# EAGLE design Minniemouse_v2 (EAGLE 9.4.0)
COMPANY: ADAFRUIT INDUSTRIES; DRAWN: KTOWN; REV: B
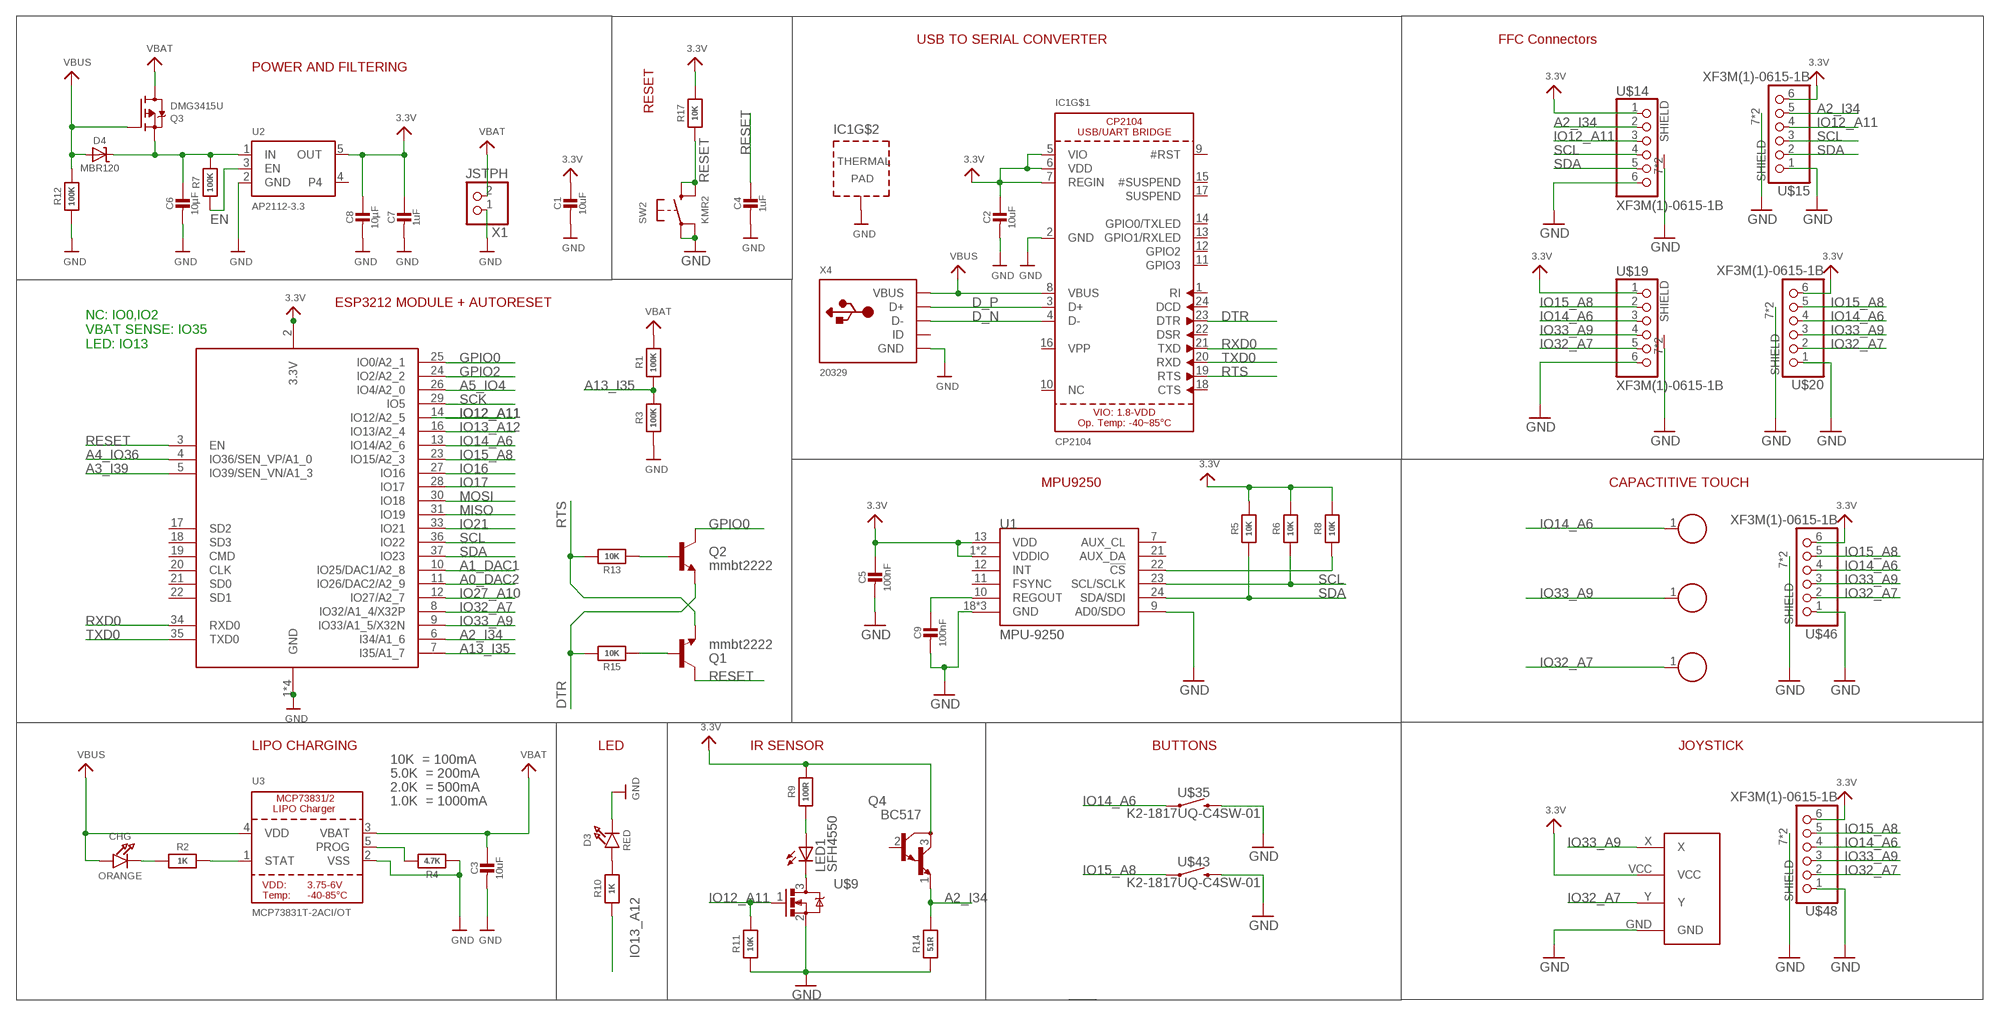
[diagram p0: schematic, sheet 1]

## Parts
C1  10uF  CAP_CERAMIC_0402  [_0402]
C2  10uF  CAP_CERAMIC_0402  [_0402]
C3  10uF  CAP_CERAMIC_0402  [_0402]
C4  1uF  CAP_CERAMIC_0402  [_0402]
C5  100nF  CAP_CERAMIC_0402  [_0402]
C6  10µF  CAP_CERAMIC_0402  [_0402]
C7  1uF  CAP_CERAMIC_0402  [_0402]
C8  10µF  CAP_CERAMIC_0402  [_0402]
C9  100nF  CAP_CERAMIC_0402  [_0402]
CHG  ORANGE  LED0805_NOOUTLINE  [CHIPLED_0805_NOOUTLINE]
D3  RED  LED0805_NOOUTLINE  [CHIPLED_0805_NOOUTLINE]
D4  MBR120  DIODE-SCHOTTKYSOD-123  [SOD-123]
IC1  CP2104  [QFN24_4MM_SMSC]
LED1  SFH4550  LED_LED5MM  [LED_LED5MM]
P1  CAPTOUCH_PAD  [CAPTOUCH_6.5X7]
P2  CAPTOUCH_PAD  [CAPTOUCH_6.5X7]
P3  CAPTOUCH_PAD  [CAPTOUCH_6.5X7]
Q1  mmbt2222  TRANSISTOR_NPNSOT23-3  [SOT23-3]
Q2  mmbt2222  TRANSISTOR_NPNSOT23-3  [SOT23-3]
Q3  DMG3415U  MOSFET-P  [SOT23-R]
Q4  BC517  [TO92]
R1  100K  RESISTOR_0402  [_0402]
R2  1K  RESISTOR_0402  [_0402]
R3  100K  RESISTOR_0402  [_0402]
R4  4.7K  RESISTOR_0402  [_0402]
R5  10K  RESISTOR_0402  [_0402]
R6  10K  RESISTOR_0402  [_0402]
R7  100K  RESISTOR_0402  [_0402]
R8  10K  RESISTOR_0402  [_0402]
R9  100R  RESISTOR_0402  [_0402]
R10  1K  RESISTOR_0402  [_0402]
R11  10K  RESISTOR_0402  [_0402]
R12  100K  RESISTOR_0402  [_0402]
R13  10K  RESISTOR_0402  [_0402]
R14  51R  RESISTOR_0402  [_0402]
R15  10K  RESISTOR_0402  [_0402]
R17  10K  RESISTOR_0402  [_0402]
SW2  KMR2  SWITCH_TACT_SMT4.6X2.8  [BTN_KMR2_4.6X2.8]
U1  MPU-9250  [QFN24_PAD]
U2  AP2112-3.3  VREG_SOT23-5  [SOT23-5]
U3  MCP73831T-2ACI/OT  MCP73831/2  [SOT23-5]
U$9  DMN6140L  [SOT91P240X110-3N]
U$14  XF3M(1)-0615-1B  [XF3M(1)-0615-1B]
U$15  XF3M(1)-0615-1B  [XF3M(1)-0615-1B]
U$19  XF3M(1)-0615-1B  [XF3M(1)-0615-1B]
U$20  XF3M(1)-0615-1B  [XF3M(1)-0615-1B]
U$35  K2-1817UQ-C4SW-01  [K2-1817UQ-C4SW-01]
U$43  K2-1817UQ-C4SW-01  [K2-1817UQ-C4SW-01]
U$46  XF3M(1)-0615-1B  [XF3M(1)-0615-1B]
U$48  XF3M(1)-0615-1B  [XF3M(1)-0615-1B]
U$49  JOYSTICK  [JOYSTICK]
X1  JSTPH  CON_JST_PH_2PIN  [JSTPH2]
X2  ESP32_WROOM32_SKINNY  [WROOM32_SKINNY]
X4  20329  USB_MICRO_20329_V2  [4UCONN_20329_V2]

## Nets
3.3V: C1.1 C2.1 C5.1 C7.1 C8.1 IC1.5(VIO) IC1.6(VDD) IC1.7(REGIN) Q4.3(C) R5.2 R6.2 R8.2 R9.2 R17.2 U1.1(VDDIO) U1.8(VDDIO) U1.13(VDD) U2.5(OUT) U$14.1 U$15.6 U$19.1 U$20.6 U$46.6 U$48.6 U$49.VCC X2.2(3.3V)
!CS: R8.1 U1.22(!CS)
A0_DAC2: X2.11(IO26/DAC2/A2_9)
A1_DAC1: X2.10(IO25/DAC1/A2_8)
A2_I34: Q4.1(E) R14.2 U$14.2 U$15.5 X2.6(I34/A1_6)
A3_I39: X2.5(IO39/SEN_VN/A1_3)
A4_IO36: X2.4(IO36/SEN_VP/A1_0)
A5_IO4: X2.26(IO4/A2_0)
A13_I35: R1.1 R3.2 X2.7(I35/A1_7)
D_N: IC1.4(D-) X4.D-
D_P: IC1.3(D+) X4.D+
DTR: IC1.23(DTR) Q2.2(E) R15.2
EN: R7.1 U2.3(EN)
GND: C1.2 C2.2 C3.2 C4.2 C5.2 C6.2 C7.2 C8.2 C9.2 D3.C IC1.2(GND) IC1.THERM(TP) R3.1 R4.1 R11.1 R12.1 R14.1 SW2.A'(P1) SW2.A(P) U1.9(AD0/SDO) U1.18(GND) U1.20(GND) U1.CENTER(GND) U2.2(GND) U3.2(VSS) U$9.2 U$14.6 U$14.7(SHIELD) U$14.8(SHIELD) U$15.1 U$15.7(SHIELD) U$15.8(SHIELD) U$19.6 U$19.7(SHIELD) U$19.8(SHIELD) U$20.1 U$20.7(SHIELD) U$20.8(SHIELD) U$35.P$2 U$43.P$2 U$46.1 U$46.7(SHIELD) U$46.8(SHIELD) U$48.1 U$48.7(SHIELD) U$48.8(SHIELD) U$49.GND X1.1 X2.1(GND) X2.15(GND) X2.38(GND) X2.P$1(GND) X4.BASE@1(GND) X4.BASE@2(GND) X4.GND X4.SPRT@1(GND) X4.SPRT@2(GND) X4.SPRT@3(GND) X4.SPRT@4(GND)
GPIO0: Q2.3(C) X2.25(IO0/A2_1)
GPIO2: X2.24(IO2/A2_2)
IO12_A11: R11.2 U$9.1 U$14.3 U$15.4 X2.14(IO12/A2_5)
IO13_A12: R10.1 X2.16(IO13/A2_4)
IO14_A6: P1.1 U$19.3 U$20.4 U$35.P$1 U$46.4 U$48.4 X2.13(IO14/A2_6)
IO15_A8: U$19.2 U$20.5 U$43.P$1 U$46.5 U$48.5 X2.23(IO15/A2_3)
IO16: X2.27(IO16)
IO17: X2.28(IO17)
IO21: X2.33(IO21)
IO27_A10: X2.12(IO27/A2_7)
IO32_A7: P3.1 U$19.5 U$20.2 U$46.2 U$48.2 U$49.Y X2.8(IO32/A1_4/X32P)
IO33_A9: P2.1 U$19.4 U$20.3 U$46.3 U$48.3 U$49.X X2.9(IO33/A1_5/X32N)
MISO: X2.31(IO19)
MOSI: X2.30(IO18)
N$1: CHG.C R2.1
N$3: R2.2 U3.1(STAT)
N$4: R4.2 U3.5(PROG)
N$5: D3.A R10.2
N$7: C6.1 D4.C Q3.2(S) R7.2 U2.1(IN)
N$8: Q2.1(B) R13.1
N$9: LED1.A R9.1
N$10: LED1.K(C) U$9.3
N$12: Q1.1(B) R15.1
REGOUT: C9.1 U1.10(REGOUT)
RESET: C4.1 Q1.3(C) R17.1 SW2.B'(S1) SW2.B(S) X2.3(EN)
RTS: IC1.19(RTS) Q1.2(E) R13.2
RXD0: IC1.21(TXD) X2.34(RXD0)
SCK: X2.29(IO5)
SCL: R6.1 U1.23(SCL/SCLK) U$14.4 U$15.3 X2.36(IO22)
SDA: R5.1 U1.24(SDA/SDI) U$14.5 U$15.2 X2.37(IO23)
TXD0: IC1.20(RXD) X2.35(TXD0)
VBAT: C3.1 Q3.3(D) R1.2 U3.3(VBAT) X1.2
VBUS: CHG.A D4.A IC1.8(VBUS) Q3.1(G) R12.2 U3.4(VDD) X4.VBUS
Unconnected: IC1.1(RI) IC1.9(#RST) IC1.10(NC) IC1.11(GPIO3) IC1.12(GPIO2) IC1.13(GPIO1/RXLED) IC1.14(GPIO0/TXLED) IC1.15(#SUSPEND) IC1.16(VPP) IC1.17(SUSPEND) IC1.18(CTS) IC1.22(DSR) IC1.24(DCD) Q4.2(B) U1.7(AUX_CL) U1.11(FSYNC) U1.12(INT) U1.21(AUX_DA) U2.4 X2.17(SD2) X2.18(SD3) X2.19(CMD) X2.20(CLK) X2.21(SD0) X2.22(SD1) X4.ID

## Notes on the sheet
- USB TO SERIAL CONVERTER | FFC Connectors
- POWER AND FILTERING
- RESET
- ESP3212 MODULE + AUTORESET
- NC: IO0,IO2
  VBAT SENSE: IO35
  LED: IO13
- MPU9250 | CAPACTITIVE TOUCH
- LIPO CHARGING | LED | IR SENSOR | BUTTONS | JOYSTICK
- 10K  = 100mA
- 5.0K  = 200mA
- 2.0K  = 500mA
- 1.0K  = 1000mA

## Library data of the parts
C1-C9 = microbuilder:CAP_CERAMIC: Ceramic Capacitors For new designs, use the packages preceded by an '_' character since they are more reliable: The following footprints should be used on most boards: _0402 - Standard footprint for regular board layouts _0603 - Standard footprint for regular board layouts _0805 - Standard footprint for regular board layouts _1206 - Standard footprint for regular board layouts For extremely tight-pitch boards where space is at a premium, the following 'micro-pitch' footprints can be used (smaller pads, no silkscreen outline, etc.): _0402MP - Micro-pitch footprint for very dense/compact boards _0603MP - Micro-pitch footprint for very dense/compact boards _0805MP - Micro-pitch footprint for very dense/compact boards _1206MP - Micro-pitch footprint for very dense/compact boards
CHG D3 = microbuilder:LED: LED 0603 - 0603 Surface Mount Package 2mA: Green LED - Low Power (3.9mcd, 2ma, 1.7Vf) - Digikey: 475-2709-2-ND Orange LED - Low Power (9.8mcd, 2ma, 1.8Vf) - Digikey: 475-1194-2-ND Red LED - Low Power (5mcd, 2ma, 1.8Vf) - Digikey: 475-1195-2-ND Yellow LED - Low Power (7mcd, 2ma, 1.8Vf) - Digikey: 475-1196-2-ND 5mA: Blue LED - Low Power (17mcd, 5ma, 2.9Vf) - Digikey: LNJ937W8CRACT-ND 0805 - 0805 Surface Mount Package 2mA: Red LED (8.8mcd, 2mA, 1.8Vf, Clear) - Low Power [Digikey: 475-2510-1-ND] Green LED (5mcd, 2mA, 1.8Vf, Clear) - Low Power [Digikey: 475-2730-1-ND] Yellow LED (11.3mcd, 2mA, 1.8Vf, Clear) - Low Power [Digikey: 475-2555-1-ND] 20mA: Red LED (104mcd, 20mA, Diffused) - LS R976 [Digikey: 475-1278-6-ND] Red LED (12mcd, 20mA, 2.0Vf, Clear) - APT2012EC [Digikey: 754-1128-1-ND] Green LED (15mcd, 20mA, 2.2Vf, Clear) - APT2012GC [Digikey: 754-1131-1-ND] Orange LED (160mcd, 20mA, 2.1Vf, Clear) - APT2012SECK [Digikey: 754-1130-1-ND] 1206 - 1206 Surface Mount Package Green LED (26mcd, 20mA, Diffused) - LG N971 [Digikey: 475-1407-6-ND] Red LED (15mcd, 20mA, Diffused) - LH N974 [Digikey: 475-1416-6-ND] Cree - Cree High-Power Surface Mount LEDs XPEBWT-L1-0000-00D50 - White 111lm 350mA 2.9Vf 6200K 110° XTEAWT-00-0000-00000LEE3 - White 114lm 350mA 2.85Vf 5000K 115° Everlight - Everlight 45-21 Series Surface Mount LEDs 45-21/QK2C-B2832AC2CB2/2T - Warm White 2000mcd 20mA 3.25Vf 3050K 120° 45-21/LK2C-B38452C4CB2/2T - Nuetral White 2000mcd 20mA 3.25Vf 4150K 120° 45-21/LK2C-B50634C6CB2/2T - Cold White 2200mcd 20mA 3.25Vf 5650K 120° PLCC2 Reverse Mount LS T77K-J1L2-1-0-2-R18-Z - Red 11.25mcd 2mA 1.8Vf 630nm 120° LO T77K-L1M2-24-Z - Orange 19.6mcd 2mA 1.8Vf 606nm 120° LY T77K-K2M1-26-Z - Yellow 15.7mcd 2mA 1.8Vf 587nm 120°
D4 = microbuilder:DIODE-SCHOTTKY
IC1 = microbuilder:CP2104: CP2104 - USB to UART Bridge VDD Output: 3.45V
LED1 = Arduino_Micro:LED_LED: LED OSRAM: - CHIPLED LG R971, LG N971, LY N971, LG Q971, LY Q971, LO R971, LY R971 LH N974, LH R974 LS Q976, LO Q976, LY Q976 LO Q996 - Hyper CHIPLED LW Q18S LB Q993, LB Q99A, LB R99A - SideLED LS A670, LO A670, LY A670, LG A670, LP A670 LB A673, LV A673, LT A673, LW A673 LH A674 LY A675 LS A676, LA A676, LO A676, LY A676, LW A676 LS A679, LY A679, LG A679 - Hyper Micro SIDELED® LS Y876, LA Y876, LO Y876, LY Y876 LT Y87S - SmartLED LW L88C, LW L88S LB L89C, LB L89S, LG L890 LS L89K, LO L89K, LY L89K LS L896, LA L896, LO L896, LY L896 - TOPLED LS T670, LO T670, LY T670, LG T670, LP T670 LSG T670, LSP T670, LSY T670, LOP T670, LYG T670 LG T671, LOG T671, LSG T671 LB T673, LV T673, LT T673, LW T673 LH T674 LS T676, LA T676, LO T676, LY T676, LB T676, LH T676, LSB T676, LW T676 LB T67C, LV T67C, LT T67C, LS T67K, LO T67K, LY T67K, LW E67C LS E67B, LA E67B, LO E67B, LY E67B, LB E67C, LV E67C, LT E67C LW T67C LS T679, LY T679, LG T679 LS T770, LO T770, LY T770, LG T770, LP T770 LB T773, LV T773, LT T773, LW T773 LH T774 LS E675, LA E675, LY E675, LS T675 LS T776, LA T776, LO T776, LY T776, LB T776 LHGB T686 LT T68C, LB T68C - Hyper Mini TOPLED® LB M676 - Mini TOPLED Santana® LG M470 LS M47K, LO M47K, LY M47K Source: http://www.osram.convergy.de LUXEON: - LUMILED® LXK2-PW12-R00, LXK2-PW12-S00, LXK2-PW14-U00, LXK2-PW14-V00 LXK2-PM12-R00, LXK2-PM12-S00, LXK2-PM14-U00 LXK2-PE12-Q00, LXK2-PE12-R00, LXK2-PE12-S00, LXK2-PE14-T00, LXK2-PE14-U00 LXK2-PB12-K00, LXK2-PB12-L00, LXK2-PB12-M00, LXK2-PB14-N00, LXK2-PB14-P00, LXK2-PB14-Q00 LXK2-PR12-L00, LXK2-PR12-M00, LXK2-PR14-Q00, LXK2-PR14-R00 LXK2-PD12-Q00, LXK2-PD12-R00, LXK2-PD12-S00 LXK2-PH12-R00, LXK2-PH12-S00 LXK2-PL12-P00, LXK2-PL12-Q00, LXK2-PL12-R00 Source: www.luxeon.com KINGBRIGHT: KA-3528ASYC Source: www.kingbright.com
P1-P3 = Minniemouse_v2:CAPTOUCH_PAD
Q1 Q2 = SparkFun:TRANSISTOR_NPN: Transistor NPN BJT configuration in SOT23 package. MMBT2222 is the common NPN we use. Double check BCE configuration again layout.
Q3 = microbuilder:MOSFET-P: P-Channel Mosfet LEGEND VDS: Voltage Drain-Source ID: Drain Current RDS(ON): Drain-Source On-State Resistance VGS(TH): Gate-Source Threshold Voltage CISS: Drain-Source Input Capacitance SOT-23 Name VDS ID RDS(ON) VGS(TH) CISS Order Number IRLML5103 30V 760mA 600 mOhm -- 75pF @ 25V Digikey: IRLML5103PBFCT-ND IRLML6401 12V 4.3A 50 mOhm 950mV @ 250µA 830pF @ 10V Digikey: IRLML6401PBFTR-ND NTR0202PL 20V 400mA 800 mOhm 2.3V @ 250uA 70pF @ 5V Digikey: NTR0202PLT1GOSTR-ND NTR4101PT1G 20V 1.8A 85 mOhm 1.2V @ 250uA 675pF @ 10V Digikey: NTR4101PT1GOSCT-ND DMP2004K 20V 600mA 900 mOhm 1V @ 250uA 175pF @ 16V Digikey: DMP2004KDICT-ND PMV65XP 20V 3.9A 76 mOhm 950mV @ 1mA 725pF @ 20V Digikey: 568-2358-2-ND TO-252 Name VDS ID RDS(ON) VGS(TH) CISS Order Number AOD417 30V 25A 34 mOhm 3V @ 250µA 920pF @ 15V Digikey: 785-1106-2-ND PowerPak Name VDS ID RDS(ON) VGS(TH) CISS Order Number AON7401 30V 12A 14 mOhm 3V @ 250µA 2600pF @ 15V Digikey: 785-1302-1-ND
Q4 = transistor-npn:BC517*: NPN Darlington Transistor
R1-R15 R17 = microbuilder:RESISTOR: Resistors For new designs, use the packages preceded by an '_' character since they are more reliable: The following footprints should be used on most boards: _0402 - Standard footprint for regular board layouts _0603 - Standard footprint for regular board layouts _0805 - Standard footprint for regular board layouts _1206 - Standard footprint for regular board layouts For extremely tight-pitch boards where space is at a premium, the following 'micro-pitch' footprints can be used (smaller pads, no silkscreen outline, etc.): _0402MP - Micro-pitch footprint for very dense/compact boards _0603MP - Micro-pitch footprint for very dense/compact boards _0805MP - Micro-pitch footprint for very dense/compact boards _1206MP - Micro-pitch footprint for very dense/compact boards
SW2 = microbuilder:SWITCH_TACT_SMT: SMT Tact Switches 6x6mm - Digikey: P12940SCT-ND KMR2 (4.6x2.8mm) - Digikey: 401-1426-1-ND EVQ-PQHB55 - Light Touch, 160GF (4.5x4.5mm) - Digikey: P8090SCT-ND KMT0 - KMT021 NGJ LHS (etc.) IP68/Waterproof - Digikey: CKN10289CT-ND
U1 = Testing:MPU-9250: NC pin 19. 2-6 & 14-17 not internally connected. May be used for PCB trace routing.; PROD_ID: IC-13192
U2 = microbuilder:VREG_SOT23-5: SOT23-5 Fixed Voltage Regulators Part Current Out V Out V In V Dropout θJA (°C/W) TJ (°C) Digikey Part No. ADP121 150mA 3.3V 3.4-5.5V 0.09V @ 150mA -- -- ADP121-AUJZ33R7CT-ND ADP121 150mA 3.0V 3.1-5.5V 0.09V @ 150mA -- -- ADP121-AUJZ30R7CT-ND ADP122 300mA 3.3V 3.4-5.5V 0.085V @ 300mA -- -- ADP122AUJZ-3.3-R7CT-ND ADP1712 300mA 3.3V 3.5-5.5V 0.17V @ 300mA -- -- ADP1712AUJZ-3.3-R7TR-ND AP7311 (Low Cost) 150mA 3.3V 3.5-6V 0.15V @ 150mA -- -- AP7311-33WG-7DICT-ND LD39015M18R 150mA 1.8V 1.9V-5.5V 0.08V @ 100mA -- -- 497-6977-1-ND LP2985A-33DBVR 150mA 3.3V 3.3-16V 0.28V @ 150mA 206 150 296-18479-1-ND MCP1824T-3302E/OT 300mA 3.3V 3.5V-6V 0.2V @ 300mA -- -- MCP1824T-3302E/OTCT-ND MIC5205-2.5YM5 TR 150mA 2.5V 2.7-16V 0.165V @ 150mA -- -- 576-1257-2-ND MIC5205-3.0YM5 TR 150mA 3.0V 3.2V-16V 0.165V @ 150mA -- -- 576-1258-2-ND MIC5205-3.3YM5 TR 150mA 3.3V 3.5V-16V 0.165V @ 150mA -- -- 576-1259-2-ND TPS780330220 150mA 3.3V+2.2V 3.6-5.5V 250mV Max -- -- 296-23332-1-ND TDA3663/N1,135 100mA 3.3V 3.5-45V 0.18V @ 50mA -- -- 568-5343-1-ND Max operating temp can be calculated using θJA, TJ (max junction temperature), and power in watts. Set the "Maximum Ambient Temperature" until it reaches TJ ("Max Junction Temperature"), which is the absolute limit for safe use of the regulator: Heat Sink Temperature Calculator <http://www.daycounter.com/Calculators/Heat-Sink-Temperature-Calculator.phtml> For example, With 12V source into a 3.3V LP2985 and a 30mA load, we are dissipating (12V-3.3V) * 0.03A = 0.261W. With a θJA of 206 °C/W, a TJ of 150°C, and 261mW we can safely use the chip without a heat sink up to 75°C (=147.1°C Junction Temperature).
U3 = microbuilder:MCP73831/2: MCP73831/2 LIPO Charger VDD: 3.75 - 6V Temp -40 - 85°C Programmable Charge Rate: 15-500mA NOTE: STAT is a tri-state logic output on the MCP73831 and an open-drain output on the MCP73832. SOT23-5 with 4.2V output and tri-state logic on STAT = MCP73831T-2ACI/OT
U$9 = DMN6140L:DMN6140L
U$14 U$15 U$19 U$20 U$46 U$48 = Neptune_custom_lib:XF3M(1)-0615-1B: 6P FFC connector
U$35 U$43 = Adafruit ESP8266 Feather rev E:K2-1817UQ-C4SW-01
U$49 = Minniemouse_v2:JOYSTICK
X1 = microbuilder:CON_JST_PH_2PIN: JST 2-Pin Right-Angle Connector PH-Series - 4UConnector: 17311 SH-Series - 4UConnector: 07278
X2 = microbuilder:ESP32_WROOM32
X4 = microbuilder:USB: USB Connectors USBMINIB - Surface Mount Female Mini-B USB Connector 4UConnector: 06564

## Board
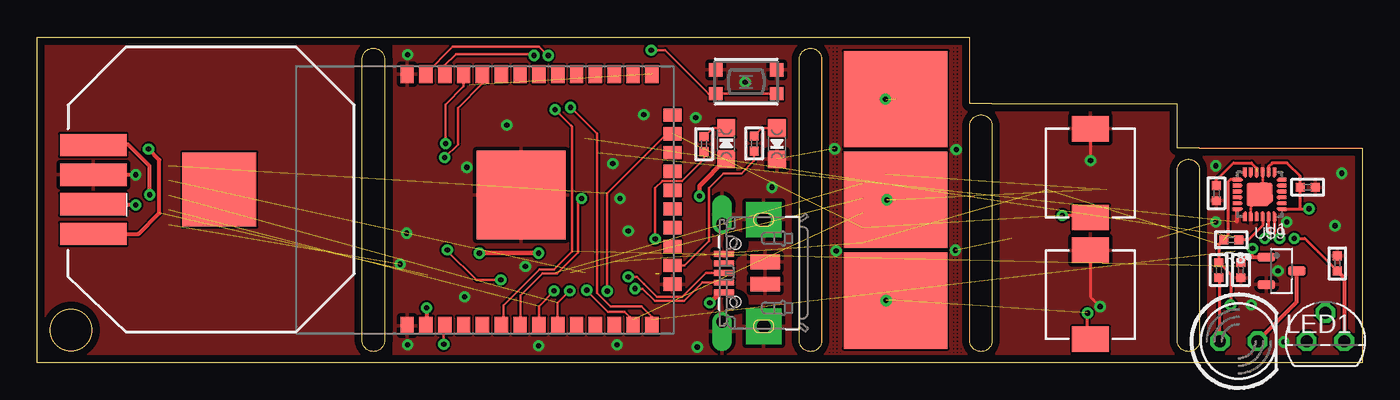
[diagram p1: board, top side]
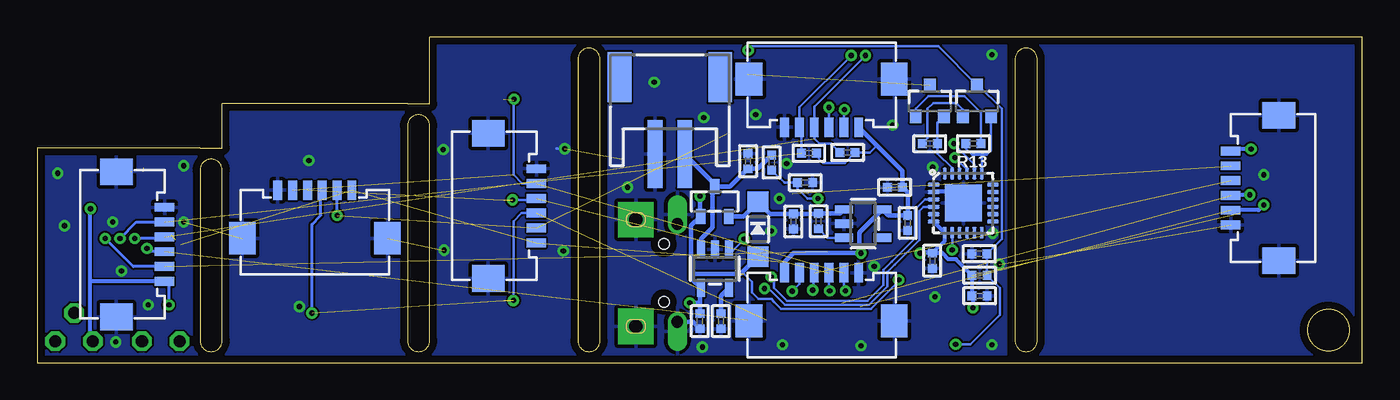
[diagram p2: board, bottom side, seen from below]

Size 89.45 x 22 mm. Coordinates in mm from the lower left corner, seen from the top.
Outline: 0,22 62.95,22 62.95,17.5 64.45,17.5 76.95,17.5 76.95,14.5 78.45,14.5 89.45,14.5 89.45,0 78.45,0 76.95,0 64.45,0 62.95,0 0,0 0,22
Outline: 64.45,16 64.45,1.5 arc-180 62.95,1.5 62.95,16 arc-180 64.45,16
Outline: 78.45,13 78.45,1.5 arc-180 76.95,1.5 76.95,13 arc-180 78.45,13
Outline: 52.95,20.5 52.95,1.5 arc-180 51.45,1.5 51.45,20.5 arc-180 52.95,20.5
Outline: 23.45,20.5 23.45,1.5 arc-180 21.95,1.5 21.95,20.5 arc-180 23.45,20.5
Outline: circle at 2.3,2.2 radius 1.4
Copper layers (1*16): Top 0.035mm / dielectric 1.5mm / Bottom 0.035mm
Design rules "default *": minimum track width 6mil, minimum drill 0.35mm, track to track 5mil, track to pad 4mil, pad to pad 4mil, via to via 5mil, smd to smd 5mil, copper to edge 20mil, drill to drill 6mil, minimum pad ring 10mil, minimum via ring 8mil, stop-mask expansion 4mil, vias tented up to drill 0.4mm, thermal gap 10mil

### Footprints (pad centres in the part's own frame; a part is rotated, then mirrored left to right if it is on the bottom)
_0402 = smd 0.6 x 0.6: 1 -0.508,0; 2 0.508,0
CHIPLED_0805_NOOUTLINE = smd 1.2 x 1.2: A 0,-1.05; C 0,1.05
SOD-123 = smd 1.4 x 1.4: A 1.85,0; C -1.85,0
QFN24_4MM_SMSC = smd 0.8 x 0.28: 1 -2,1.25; 2 -2,0.75; 3 -2,0.25; 4 -2,-0.25; 5 -2,-0.75; 6 -2,-1.25; 13 2,-1.25; 14 2,-0.75; 15 2,-0.25; 16 2,0.25; 17 2,0.75; 18 2,1.25 | smd 0.28 x 0.8: 7 -1.25,-2; 8 -0.75,-2; 9 -0.25,-2; 10 0.25,-2; 11 0.75,-2; 12 1.25,-2; 19 1.25,2; 20 0.75,2; 21 0.25,2; 22 -0.25,2; 23 -0.75,2; 24 -1.25,2 | smd 2.5 x 2.5: THERM 0,0
LED_LED5MM = drill 0.813 octagon: A -1.27,0; K 1.27,0
CAPTOUCH_6.5X7 = smd 6.5 x 7: 1 0,0
SOT23-3 = smd 0.8 x 0.9: 1 -0.95,-1; 2 0.95,-1; 3 0,1.1
SOT23-R = smd 0.635 x 1.016: 1 -0.95,-1; 2 0.95,-1; 3 0,1
TO92 = drill 0.813 octagon: 1 1.27,0; 2 0,1.905; 3 -1.27,0
BTN_KMR2_4.6X2.8 = smd 0.9 x 0.9: A 2.05,0.8; A' -2.05,0.8; B 2.05,-0.8; B' -2.05,-0.8
QFN24_PAD = smd 0.5 x 0.25: 1 -1.55,1; 2 -1.55,0.6; 3 -1.55,0.2; 4 -1.55,-0.2; 5 -1.55,-0.6; 6 -1.55,-1; 13 1.55,-1; 14 1.55,-0.6; 15 1.55,-0.2; 16 1.55,0.2; 17 1.55,0.6; 18 1.55,1 | smd 0.08 x 0.13: 1$1 -1.32,1.06; 1$3 -1.26,0.94; P$33 1.26,-0.94; P$34 1.32,-1.06; P$58 1.26,0.94; P$59 1.32,1.06; P$68 -1.26,-0.94; P$69 -1.32,-1.06 | smd 0.1 x 0.185 rotated 45: 1$2 -1.25,1.024; P$49 1.024,-1.25 | smd 0.14 x 0.14: 1$4 -1.22,0.945; P$23 -0.945,-1.22; P$24 1.22,-0.945; P$36 0.945,1.22; P$51 0.945,-1.22; P$56 1.22,0.945; P$61 -0.945,1.22; P$66 -1.22,-0.945 | smd 0.05 x 0.05: 1$5 -1.175,0.97; P$25 -0.97,-1.175; P$31 1.175,-0.97; P$37 0.97,1.175; P$52 0.97,-1.175; P$57 1.175,0.97; P$62 -0.97,1.175; P$67 -1.175,-0.97 | smd 0.25 x 0.5: 7 -1,-1.55; 8 -0.6,-1.55; 9 -0.2,-1.55; 10 0.2,-1.55; 11 0.6,-1.55; 12 1,-1.55; 19 1,1.55; 20 0.6,1.55; 21 0.2,1.55; 22 -0.2,1.55; 23 -0.6,1.55; 24 -1,1.55 | smd 0.25 x 0.25: CENTER 0,0 | smd 0.4 x 0.4: DBBADFE -0.675,0.24 | smd 0.6 x 1.2: DBBADFE1 -0.575,-0.195 | smd 0.25 x 0.3: P$1 -0.2,1.3; P$3 0.2,1.3; P$5 0.6,1.3; P$11 -0.6,1.3; P$16 0.2,-1.3; P$18 -0.2,-1.3; P$20 -0.6,-1.3; P$26 0.6,-1.3 | smd 0.3 x 0.25: P$2 -1.3,0.2; P$4 -1.3,0.6; P$28 -1.3,-0.2; P$38 -1.3,-0.6; P$40 1.3,0.2; P$42 1.3,-0.2; P$44 1.3,-0.6; P$50 1.3,0.6 | smd 0.1 x 0.185 rotated 225: P$7 1.25,-1.024; P$60 -1.024,1.25 | smd 1.1 x 1.59: P$13 0.325,0 | smd 0.3 x 0.5 rotated 315: P$14 -0.592,0.512 | smd 0.5 x 1.59: P$15 -0.27,0 | smd 0.1 x 0.185 rotated 135: P$22 -1.024,-1.25; P$55 1.25,1.024 | smd 0.13 x 0.08: P$27 -0.94,-1.26; P$29 -1.06,-1.32; P$39 0.94,1.26; P$41 1.06,1.32; P$53 0.94,-1.26; P$54 1.06,-1.32; P$63 -0.94,1.26; P$64 -1.06,1.32 | smd 0.1 x 0.185 rotated 315: P$35 1.024,1.25; P$65 -1.25,-1.024
SOT23-5 = smd 0.55 x 1.2: 1 -0.95,-1.3; 2 0,-1.3; 3 0.95,-1.3; 4 0.95,1.3; 5 -0.95,1.3
SOT91P240X110-3N = smd 1.18 x 0.61: 1 -1.025,0.915; 2 -1.025,-0.915; 3 1.025,0
XF3M(1)-0615-1B = smd 0.6 x 1.3: 1 -2.5,0; 2 -1.5,0; 3 -0.5,0; 4 0.5,0; 5 1.5,0; 6 2.5,0 | smd 1.8 x 2.2: 7 -4.9,-3.25; 8 4.9,-3.25
K2-1817UQ-C4SW-01 = smd 1.7 x 2.5: P$1 -3,0; P$2 3,0
JOYSTICK = smd 5 x 5: 1 0,-8.5 | smd 1.5 x 4.5: GND 1,0; VCC -3,0; X 3,0; Y -1,0
JSTPH2 = smd 1 x 4.6: 1 -1,-3.7; 2 1,-3.7 | smd 1.6 x 3.4: NC1 -3.4,1.5; NC2 3.4,1.5
WROOM32_SKINNY = smd 1.2 x 0.9: 1 -8.5,5; 2 -8.5,3.73; 3 -8.5,2.46; 4 -8.5,1.19; 5 -8.5,-0.08; 6 -8.5,-1.35; 7 -8.5,-2.62; 8 -8.5,-3.89; 9 -8.5,-5.16; 10 -8.5,-6.43; 11 -8.5,-7.7; 12 -8.5,-8.97; 13 -8.5,-10.24; 14 -8.5,-11.51; 25 8.5,-11.51; 26 8.5,-10.24; 27 8.5,-8.97; 28 8.5,-7.7; 29 8.5,-6.43; 30 8.5,-5.16; 31 8.5,-3.89; 32 8.5,-2.62; 33 8.5,-1.35; 34 8.5,-0.08; 35 8.5,1.19; 36 8.5,2.46; 37 8.5,3.73; 38 8.5,5 | smd 0.9 x 1.2: 15 -5.7,-12.9; 16 -4.43,-12.9; 17 -3.16,-12.9; 18 -1.89,-12.9; 19 -0.62,-12.9; 20 0.65,-12.9; 21 1.92,-12.9; 22 3.19,-12.9; 23 4.46,-12.9; 24 5.73,-12.9 | smd 6 x 6: P$1 0.34,-2.7
4UCONN_20329_V2 = smd 1 x 2: BASE@1 -0.75,-2; BASE@2 0.75,-2 | smd 0.4 x 1.35: D+ 0,0.775; D- -0.65,0.775; GND 1.3,0.775; ID 0.65,0.775; VBUS -1.3,0.775 | drill 0.8 pad 1.143 offset: SPRT@1 -3.3,0.9; SPRT@2 3.3,0.9 | drill 0.9 pad 2.413 square: SPRT@3 -3.6,-1.9; SPRT@4 3.6,-1.9 | hole 0.7: -1.95,0; 1.95,0

### Placement (x,y rotation side)
C1  25.84,4.52 0 bottom
C2  29.03,6.89 270 bottom
C3  41.46,13.61 90 bottom
C4  25.86,7.36 180 bottom
C5  85.75,11.85 0 top
C6  38.41,9.54 270 bottom
C7  31.56,11.85 180 bottom
C8  30.69,9.44 270 bottom
C9  79.6,11.45 270 top
CHG  46.51,14.81 0 top
D3  49.93,14.79 180 top
D4  40.8,9.02 270 bottom
IC1  26.94,10.78 0 bottom
LED1  81.1,1.45 0 top
P1  57.95,4.2 90 top
P2  57.95,11 90 top
P3  57.95,17.8 90 top
Q1  26.01,17.65 0 bottom
Q2  29.2,17.65 0 bottom
Q3  43.72,10.89 0 bottom
Q4  86.95,1.45 0 top
R1  39.87,13.53 90 bottom
R2  45.02,14.76 270 top
R3  37.61,12.16 180 bottom
R4  43.3,2.81 90 bottom
R5  37.35,14.15 0 bottom
R6  34.75,14.2 0 bottom
R7  36.71,9.56 90 bottom
R8  80.6,8.3 180 top
R9  79.75,6.25 90 top
R10  48.4,14.81 90 top
R11  81.25,6.25 90 top
R12  44.72,2.81 90 bottom
R13  26.25,14.8 180 bottom
R14  87.75,6.7 270 top
R15  29.2,14.8 0 bottom
R17  25.84,5.9 180 bottom
SW2  47.86,18.98 0 top
U1  82.51,11.37 180 top
U2  33.7,9.39 270 bottom
U3  43.7,6.35 180 bottom
U$9  83.99,6.2 0 top
U$14  36.5,15.9 180 bottom
U$15  80.85,8 270 bottom
U$19  36.5,6.08 0 bottom
U$20  70.7,11.65 0 bottom
U$35  71.09,4.6 90 top
U$43  71.1,12.8 90 top
U$46  55.75,10.6 270 bottom
U$48  8.9,11.8 90 bottom
U$49  3.8,11.7 90 top
X1  46.74,17.79 0 bottom
X2  29.98,11 90 top
X4  47.14,6.06 90 top

### Tracks (layer width: path | path; a pad name or v marks a point on that pad's centre or on a via)
3.3V  (via drill 0.35)  (6 unrouted)
  Top 0.203: 85.25,12.6 84.35,13.5 83.35,13.5 83.11,13.26 83.11,12.87 | U1.13 80.52,12.37 80.35,12.2 80.35,8.6 79.75,8 R9.2 80.55,5.96 v80.55,3.9 | U1.1 84.75,10.37 85.25,10.37 | 85.25,10.37 85.82,10.37 v85.85,10.4 | 85.25,10.37 85.25,12.6 | C5.1 85.24,12.59 85.25,12.6
  Top 0.254: v26.3,3.7 26.3,2.55 | U$49.VCC 6.85,8.7 8.25,10.1 8.25,13.7 v7.53,14.42 v7.52,14.42
  Top 0.305: X2.2 26.3,2.55 | v29.85,7.4 v33.85,7.4
  Bottom 0.152: 28.19,8.75 IC1.7 | 32.77,14.68 33.25,14.2 R6.2 34.94,13.5 36.4,13.5 36.84,13.94 R5.2
  Bottom 0.203: U$15.6 80.55,5.2 v80.55,3.9 | Q4.3 85.89,1.66
  Bottom 0.254: U$15.6 85.69,5.5 85.89,5.5 | v85.85,10.4 85.89,10.36 85.89,5.5 | 85.89,5.5 85.89,1.66 | IC1.7 IC1.6 IC1.5 | C2.1 28.19,8.24 28.19,8.75 | 28.6,7.4 28.36,7.4 27.95,6.98 27.43,6.98 R17.2 C1.1 26.3,4.52 v26.3,3.7 | v7.52,14.42 8.78,14.42 U$48.6
  Bottom 0.305: U$19.1 39,6.8 38.4,7.4 33.95,7.4 | v29.85,7.4 29.65,7.4 29.65,7.45 29.08,7.45 C2.1 28.6,7.4 28.55,7.4 | U$14.1 32.77,14.68 32.4,14.3 31.05,12.95 C7.1 30.69,11.49 C8.1 32.01,9.95 U2.5 33.95,8.79 33.95,7.4 | v33.85,7.4 33.95,7.4
!CS
  Top 0.203: U1.22 82.71,9.26 81.75,8.3 R8.1
A2_I34  (via drill 0.35)  (1 unrouted)
  Top 0.152: v34.95,17.1 36.05,16 36.1,15.95 36.1,7.53 34.88,6.31 33.91,6.31 31.47,3.87 31.47,2.64 X2.6
  Top 0.203: v84.85,8.4 85.54,8.4 R14.2
  Top 0.254: R14.2 88.22,5.72 Q4.1
  Bottom 0.152: U$14.2 35,17.05 v34.95,17.1
  Bottom 0.203: U$15.5 82.95,6.5 v84.85,8.4
A13_I35  (via drill 0.35)
  Top 0.152: v36.75,11.1 36.5,10.85 36.5,7.45 35.08,6.03 34.11,6.03 32.62,4.54 32.62,2.52 X2.7
  Bottom 0.152: R1.1 39.01,12.16 R3.2 38.12,11.77 37.45,11.1 v36.75,11.1
D_N  (via drill 0.35)
  Top 0.152: X4.D- 44.91,5.41 43.66,4.16 41.7,4.16 40.86,5 v40.35,5
  Bottom 0.152: v40.35,5 40.05,5 38.96,3.91 33.29,3.91 32.06,5.14 32.06,5.8 32.06,6.14 31.55,6.65 29.91,8.29 29.91,9.1 29.91,10.25 29.63,10.53 IC1.4
D_P  (via drill 0.35)
  Top 0.152: X4.D+ 45.16,6.06 43.54,4.44 41.9,4.44 41.85,4.44 40.95,5.34 40.49,5.8 v39.9,5.8
  Bottom 0.152: 32.34,5.26 33.41,4.19 38.84,4.19 39.7,5.05 39.7,5.6 v39.9,5.8 | 32.34,5.26 32.34,5.5 | 32.34,5.26 32.34,5.5 | 32.34,5.5 32.34,6.26 31.75,6.85 30.19,8.41 30.19,10.37 29.52,11.03 IC1.3
DTR
  Bottom 0.152: Q2.2 28.69,16.21 R15.2 28.69,14.14 27.69,13.14 IC1.23
EN
  Bottom 0.152: U2.3 36.1,8.44 R7.1
GND  (via drill 0.35)  (4 unrouted)
  Top 0.152: U1.9 82.71,11.57 U1.CENTER 82.51,11.07 81.91,10.47 U1.20 | 80.96,9.54 81,9.5
  Top 0.203: U$35.P$2 71.09,4.45 v71.74,3.79 | U$43.P$2 v71.1,13.65
  Top 0.254: U1.18 80.96,9.54 | U$49.GND v6.65,12.7
  Bottom 0.152: 54.4,14.45 v53.84,14.45
  Bottom 0.254: IC1.THERM 27.71,11.55 28.92,11.55 IC1.2
  Bottom 0.305: X4.SPRT@1 45.18,2.76 R12.1
  other vias: 84.15,1.4 88.05,12.8 83.75,6.2 81.95,3.9 79.55,9.5 53.94,7.55 61.99,7.6 62.04,14.4 39.15,1.2 33.85,1.15 44.55,1.05 49.6,11.85 47.8,18.95 44.45,16.55 40.95,16.75 31.7,16.05 28.85,4.45 39.9,8.9 32.95,6.5 29,13.2 38.85,13.45 39.35,11.1 25,1.2 24.5,6.65 24.95,8.75 87.6,9.25 84.35,9.5 79.55,13.3 25,20.8
  pour Bottom: 78.65,0.1 78.65,14.4 89.55,14.4 89.55,0.1
  pour Top: 78.65,0.1 78.65,14.3 89.55,14.3 89.55,0.1
  pour Bottom: 64.35,0.1 64.35,17.4 76.95,17.4 76.95,0.1
  pour Top: 64.35,0 64.35,17.4 76.95,17.4 76.95,0
  pour Top (hatched): 52.9,0 52.9,22 62.9,22 62.9,0.05 62.95,0
  pour Bottom: 52.85,0 52.85,22 62.95,22 62.95,0
  pour Bottom: 24.05,0 24.05,21.9 51.85,21.9 51.85,0
  pour Top: 24.05,-0.05 24.05,22.15 51.3,22.15 51.3,-0.05
  pour Top: 21.9,0.05 21.9,22.05 -0.1,22.05 -0.1,0.05
  pour Bottom: -0.05,0.05 21.85,0.05 21.85,22.05 -0.05,22.05
GPIO0  (1 unrouted)
IO12_A11  (via drill 0.35)  (1 unrouted)
  Top 0.152: 41.49,2.91 41.49,2.65 | 41.49,2.65 41.49,3.1 40.79,3.8 38.69,3.8 37.78,4.71 37.78,15.47 v36,17.25 | 41.49,2.65 X2.14
  Top 0.203: 82,7.12 82,7.69 v82.03,7.72
  Top 0.254: U$9.1 82,7.12 81.61,7.12 R11.2
  Bottom 0.152: U$14.3 v36,17.25
  Bottom 0.203: U$15.4 81.81,7.5 v82.03,7.72
IO13_A12
  Top 0.152: X2.16 43.71,6.57 45.36,8.22 45.36,11.81 46.33,12.78 47.53,12.78 48.4,13.65 R10.1
IO14_A6  (via drill 0.35)  (4 unrouted)
  Top 0.152: X2.13 40.22,2.88 39.65,3.45 38.55,3.45 v37.1,4.9
  Top 0.203: U$35.P$1 70.9,1.79 v70.9,3.35
  Bottom 0.152: U$46.4 56.75,10.1 57.3,9.55 v57.3,4.2 | v37.1,4.9 37.05,4.95 37.05,6.03 U$19.3
  Bottom 0.203: v70.9,3.35 70.9,9.35 70.3,9.95 70.3,11.55 U$20.4
IO15_A8  (via drill 0.35)  (3 unrouted)
  Top 0.152: v38.48,4.83 38.48,11.43 42.51,15.46 X2.23
  Top 0.203: 71.36,10.06 U$43.P$1 70.95,9.95 v69.2,9.95
  Bottom 0.152: U$19.2 38,5.32 v38.48,4.83
  Bottom 0.203: v69.2,9.95 U$20.5
IO32_A7  (via drill 0.35)  (4 unrouted)
  Top 0.152: X2.8 33.87,3.82 v34.9,4.85
  Top 0.254: U$49.Y 6.6,10.7 v6.65,10.65
  Bottom 0.152: U$46.2 56.7,12.1 57.3,12.7 57.3,17.75 v57.25,17.8 | v34.9,4.85 35,4.95 35,5.25 U$19.5
  Bottom 0.254: v6.65,10.65 7,10.3 U$48.2
IO33_A9  (via drill 0.35)  (4 unrouted)
  Top 0.152: v35.95,4.85 35.14,4.04 X2.9
  Top 0.254: v7.6,11.35 7.6,13.3 6.15,14.75 3.85,14.75 U$49.X
  Bottom 0.152: U$46.3 55.85,11 v57.35,11 | v35.95,4.85 36,4.9 U$19.4
  Bottom 0.254: U$48.3 8.85,11.35 v7.6,11.35
N$1
  Top 0.152: CHG.C 45.61,15.86 R2.1
N$3  (via drill 0.35)
  Top 0.152: v41.72,8.37 41.72,11.79 42.21,12.28 43.54,12.28 45.02,13.76 R2.2
  Bottom 0.152: U3.1 42.7,7.6 42.48,7.6 v41.72,8.37
N$4
  Bottom 0.305: R4.2 43.3,4.5 U3.5
N$5
  Top 0.152: D3.A 48.92,15.84 R10.2
N$7
  Bottom 0.305: Q3.2 41.78,9.89 D4.C 39.98,10.05 C6.1 36.73,10.05 R7.2 35.27,10.07 U2.1
N$8
  Bottom 0.152: Q2.1 30.15,17.15 29.3,18 26.85,18 25.74,16.89 R13.1
N$9
  Top 0.203: LED1.A 79.83,5.66 R9.1
N$10
  Top 0.254: LED1.K 83.88,2.96 85.01,4.1 U$9.3
N$12
  Bottom 0.152: Q1.1 26.96,17.11 27.4,17.55 28.95,17.55 29.35,17.15 29.35,15.16 R15.1
REGOUT  (1 unrouted)
  Top 0.203: C9.1 79.6,12.35 80.75,13.5 81.95,13.5 82.29,13.16 82.29,12.6 82.31,12.57
RESET  (via drill 0.35)
  Top 0.152: X2.3 27.45,2.43 v27.45,1.25 | v41.45,21.11 42.39,21.11 45.32,18.18 45.65,18.18 | 45.65,18.18 SW2.B' | SW2.B 45.65,18.18
  Bottom 0.152: v41.45,21.11 41.2,21.36 28.62,21.36 Q1.3 25.95,18.75 24.35,17.15 24.35,8.36 C4.1 25.35,5.92 R17.1 24.48,5.05 24.48,3.22 26.45,1.25 v27.45,1.25
RTS
  Bottom 0.152: 26.76,14.95 R13.2 26.76,14.46 26.35,14.05 25.69,14.05 | 25.69,14.05 25.69,13.95 25.69,13.8 IC1.19 | Q1.2 25.06,14.34 25.35,14.05 25.69,14.05
RXD0  (via drill 0.35)
  Top 0.152: v27.5,13.85 28.4,14.75 28.4,17.21 30.06,18.87 X2.34
  Bottom 0.152: IC1.21 26.7,13.05 v27.5,13.85
SCL  (via drill 0.35)  (1 unrouted)
  Top 0.152: X2.36 27.47,19.55 27.47,20.05 28.27,20.85 33.45,20.85 v33.55,20.75
  Top 0.203: U1.23 83.11,8.66 v82.85,8.4
  Bottom 0.152: R6.1 35.86,14.8 36.65,14.8 37,15.15 U$14.4 37,17.3 v33.55,20.75
  Bottom 0.203: U$15.3 80.95,8.4 v82.85,8.4
SDA  (via drill 0.35)  (1 unrouted)
  Top 0.152: X2.37 26.25,19.53 28.05,21.33 33.89,21.33 34.47,20.75 v34.5,20.75
  Top 0.203: U1.24 83.51,8.74 v83.85,8.4
  Bottom 0.152: R5.1 37.86,15.76 U$14.5 38,17.25 v34.5,20.75
  Bottom 0.203: v83.85,8.4 82.75,9.5 U$15.2
TXD0  (via drill 0.35)
  Top 0.152: v27.56,14.8 27.56,17.44 28.79,18.67 X2.35
  Bottom 0.152: IC1.20 26.19,13.38 27.56,14.75 v27.56,14.8
VBAT
  Bottom 0.305: 43.72,12.07 Q3.3 42.67,11.89 C3.1 40.81,13.1 R1.2 | 43.72,12.07 X1.2 | U3.3 44.65,8.35 43.85,9.15 43.85,11.94 43.72,12.07
VBUS  (via drill 0.35)  (1 unrouted)
  Top 0.152: v27.68,7.62 27.68,7.57 29.65,5.6 v31.3,5.6
  Top 0.305: X4.VBUS 46.11,4.76 v45.4,4.05 | v44.7,11.25 44.7,11.95 CHG.A
  Bottom 0.152: 44.8,5.05 U3.4 | 41.75,6 41.2,5.45 41.2,4.75 40.75,4.3 39.9,4.3 39.7,4.1 39.23,3.63 33.18,3.63 31.3,5.51 v31.3,5.6 | v27.68,7.62 v27.69,7.62 IC1.8
  Bottom 0.305: 45.3,6 45.3,5.7 U3.4 44.72,4.98 44.72,4.05 | 45.3,6 45.3,6.4 45.3,9.26 Q3.1 44.7,9.92 v44.7,11.25 | R12.2 44.72,4.05 | 45.3,6 42.25,6 41.97,6 D4.A | v45.4,4.05 44.72,4.05

### Text on the board
Document: Joystick | Capacitive / Touch input | Buttons x 2 | MPU9250, / IR sensor | ESP32, V-Reg, / Battery charger, / USB to UART